# EasyEDA schematic SCH_New-Device-Whole-Board_2024-05-06.json

## Sheets
1 LED_Driver copy copy: TITLE: LED_Driver; REV: 1.0; Date: 2024-02-21; Sheet: 1/1; Company: Your Company
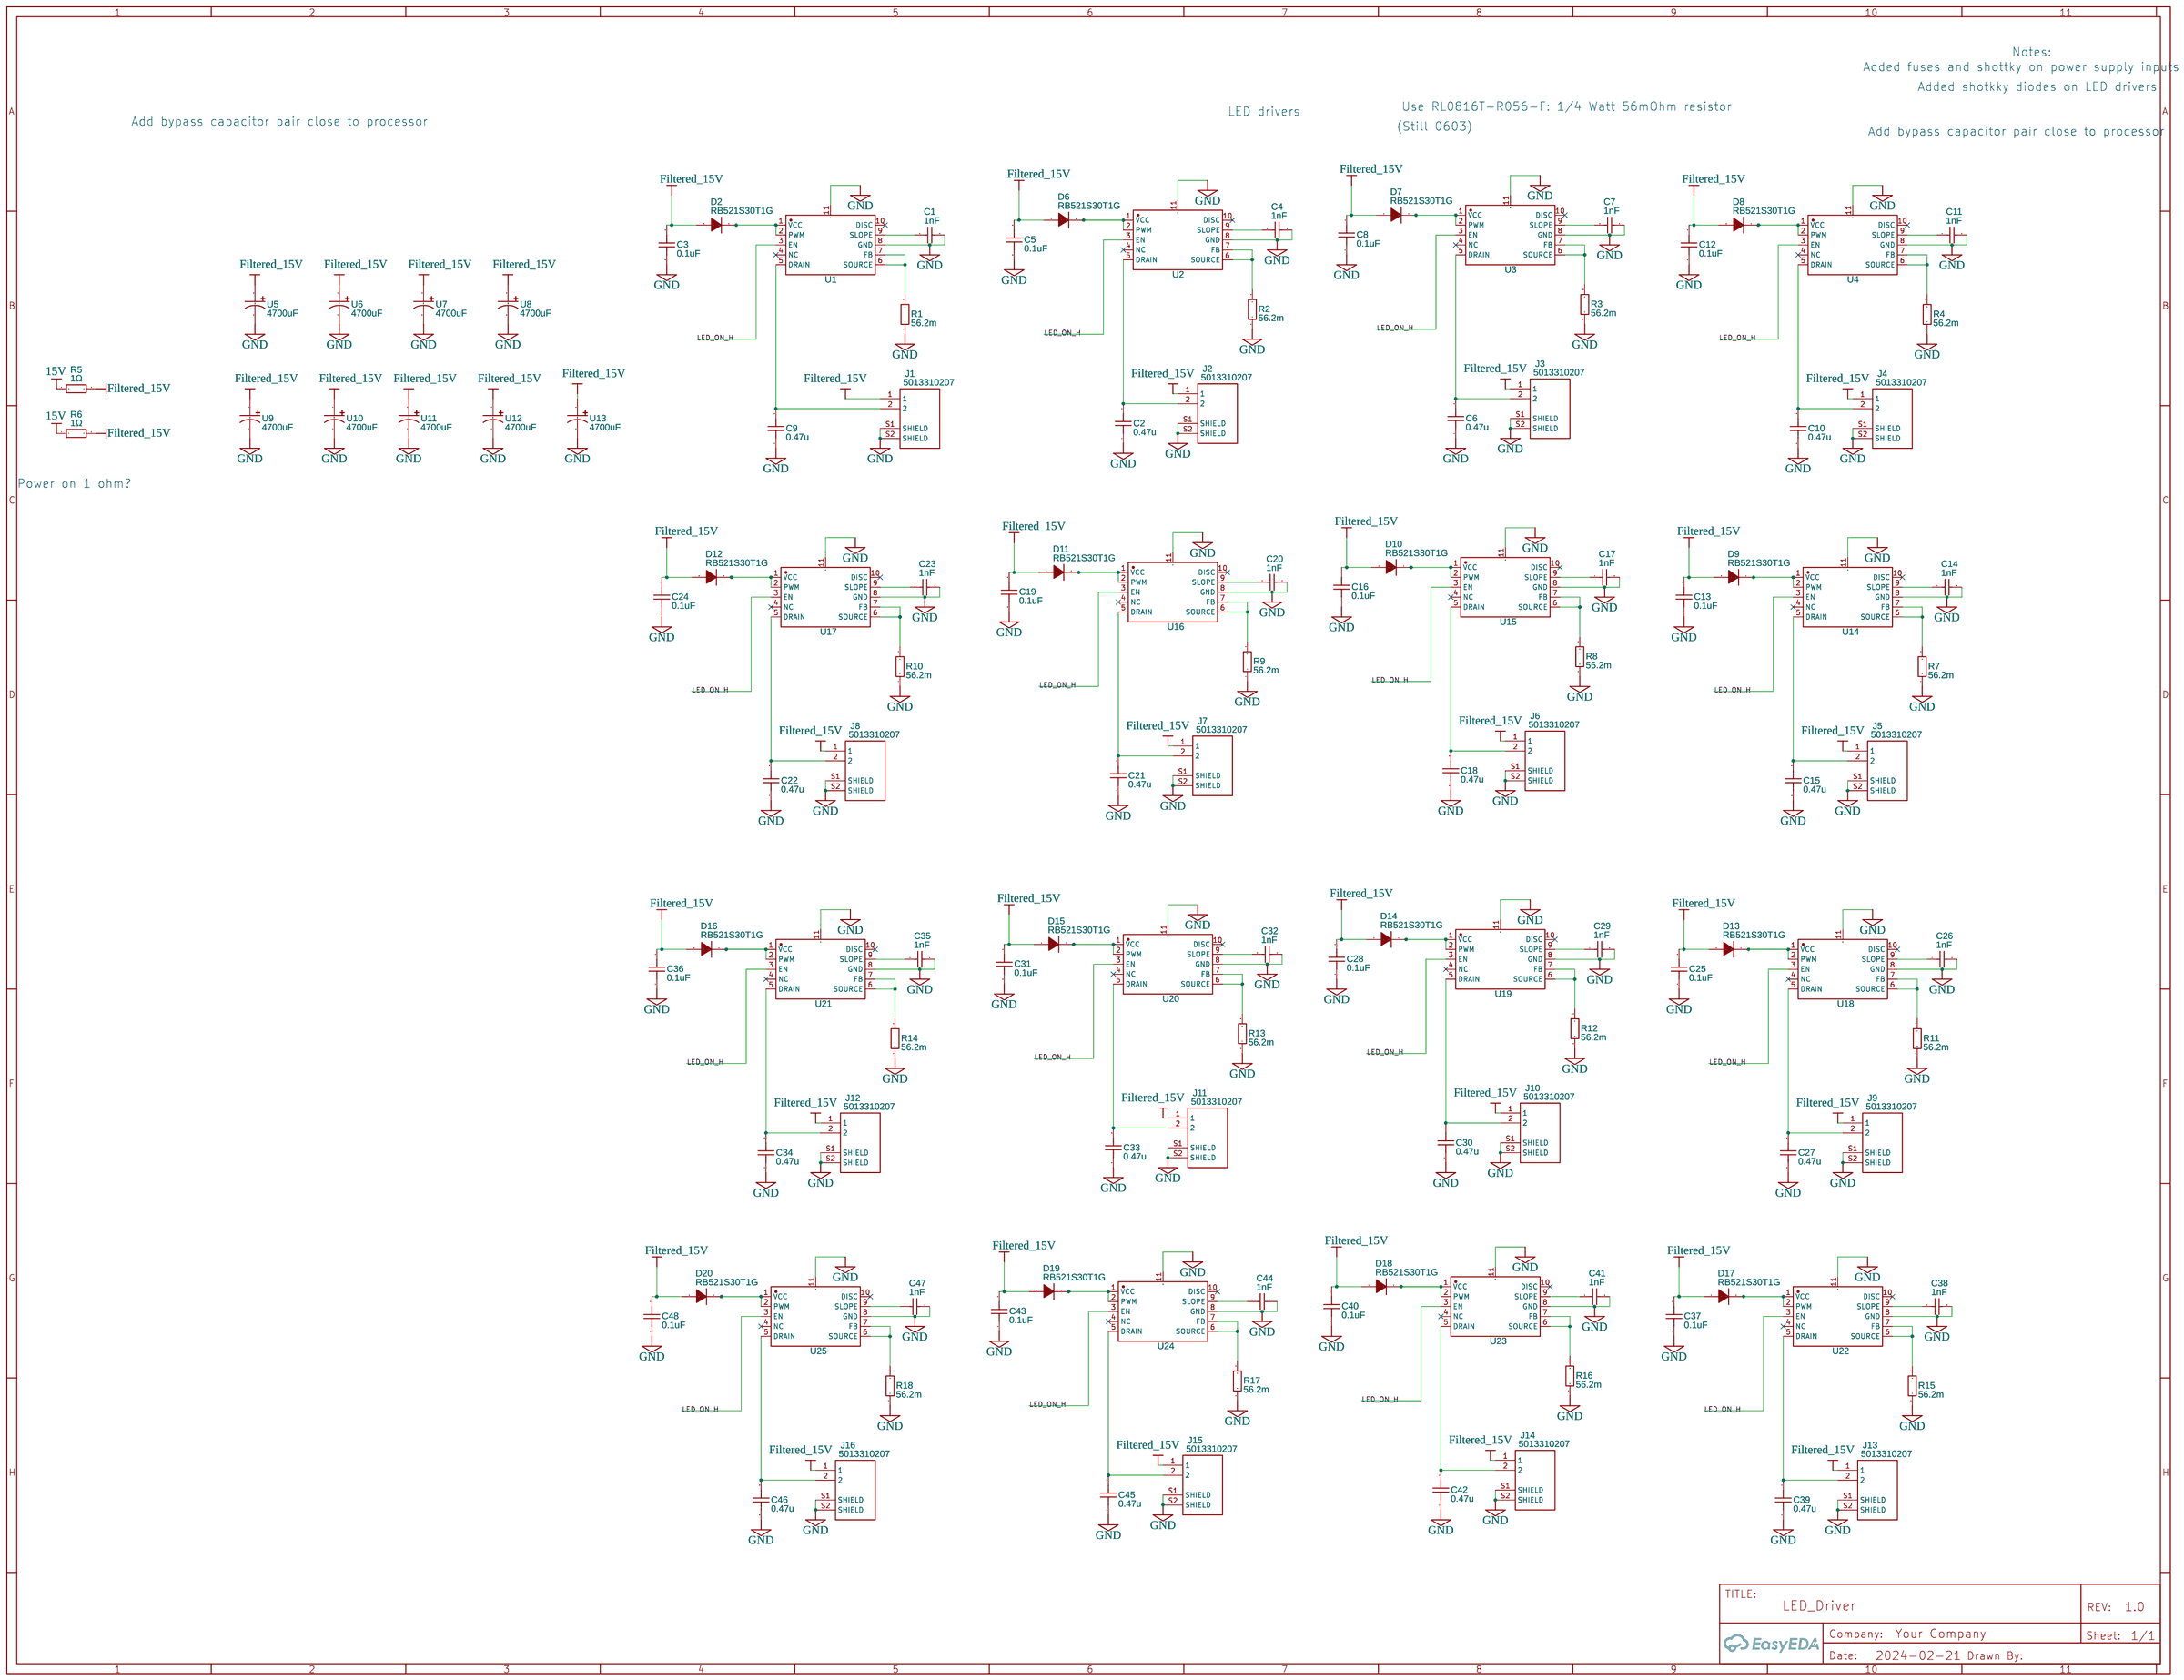
[diagram p0: LED_Driver copy copy]
2 Power_ORing copy copy: TITLE: Power_ORing
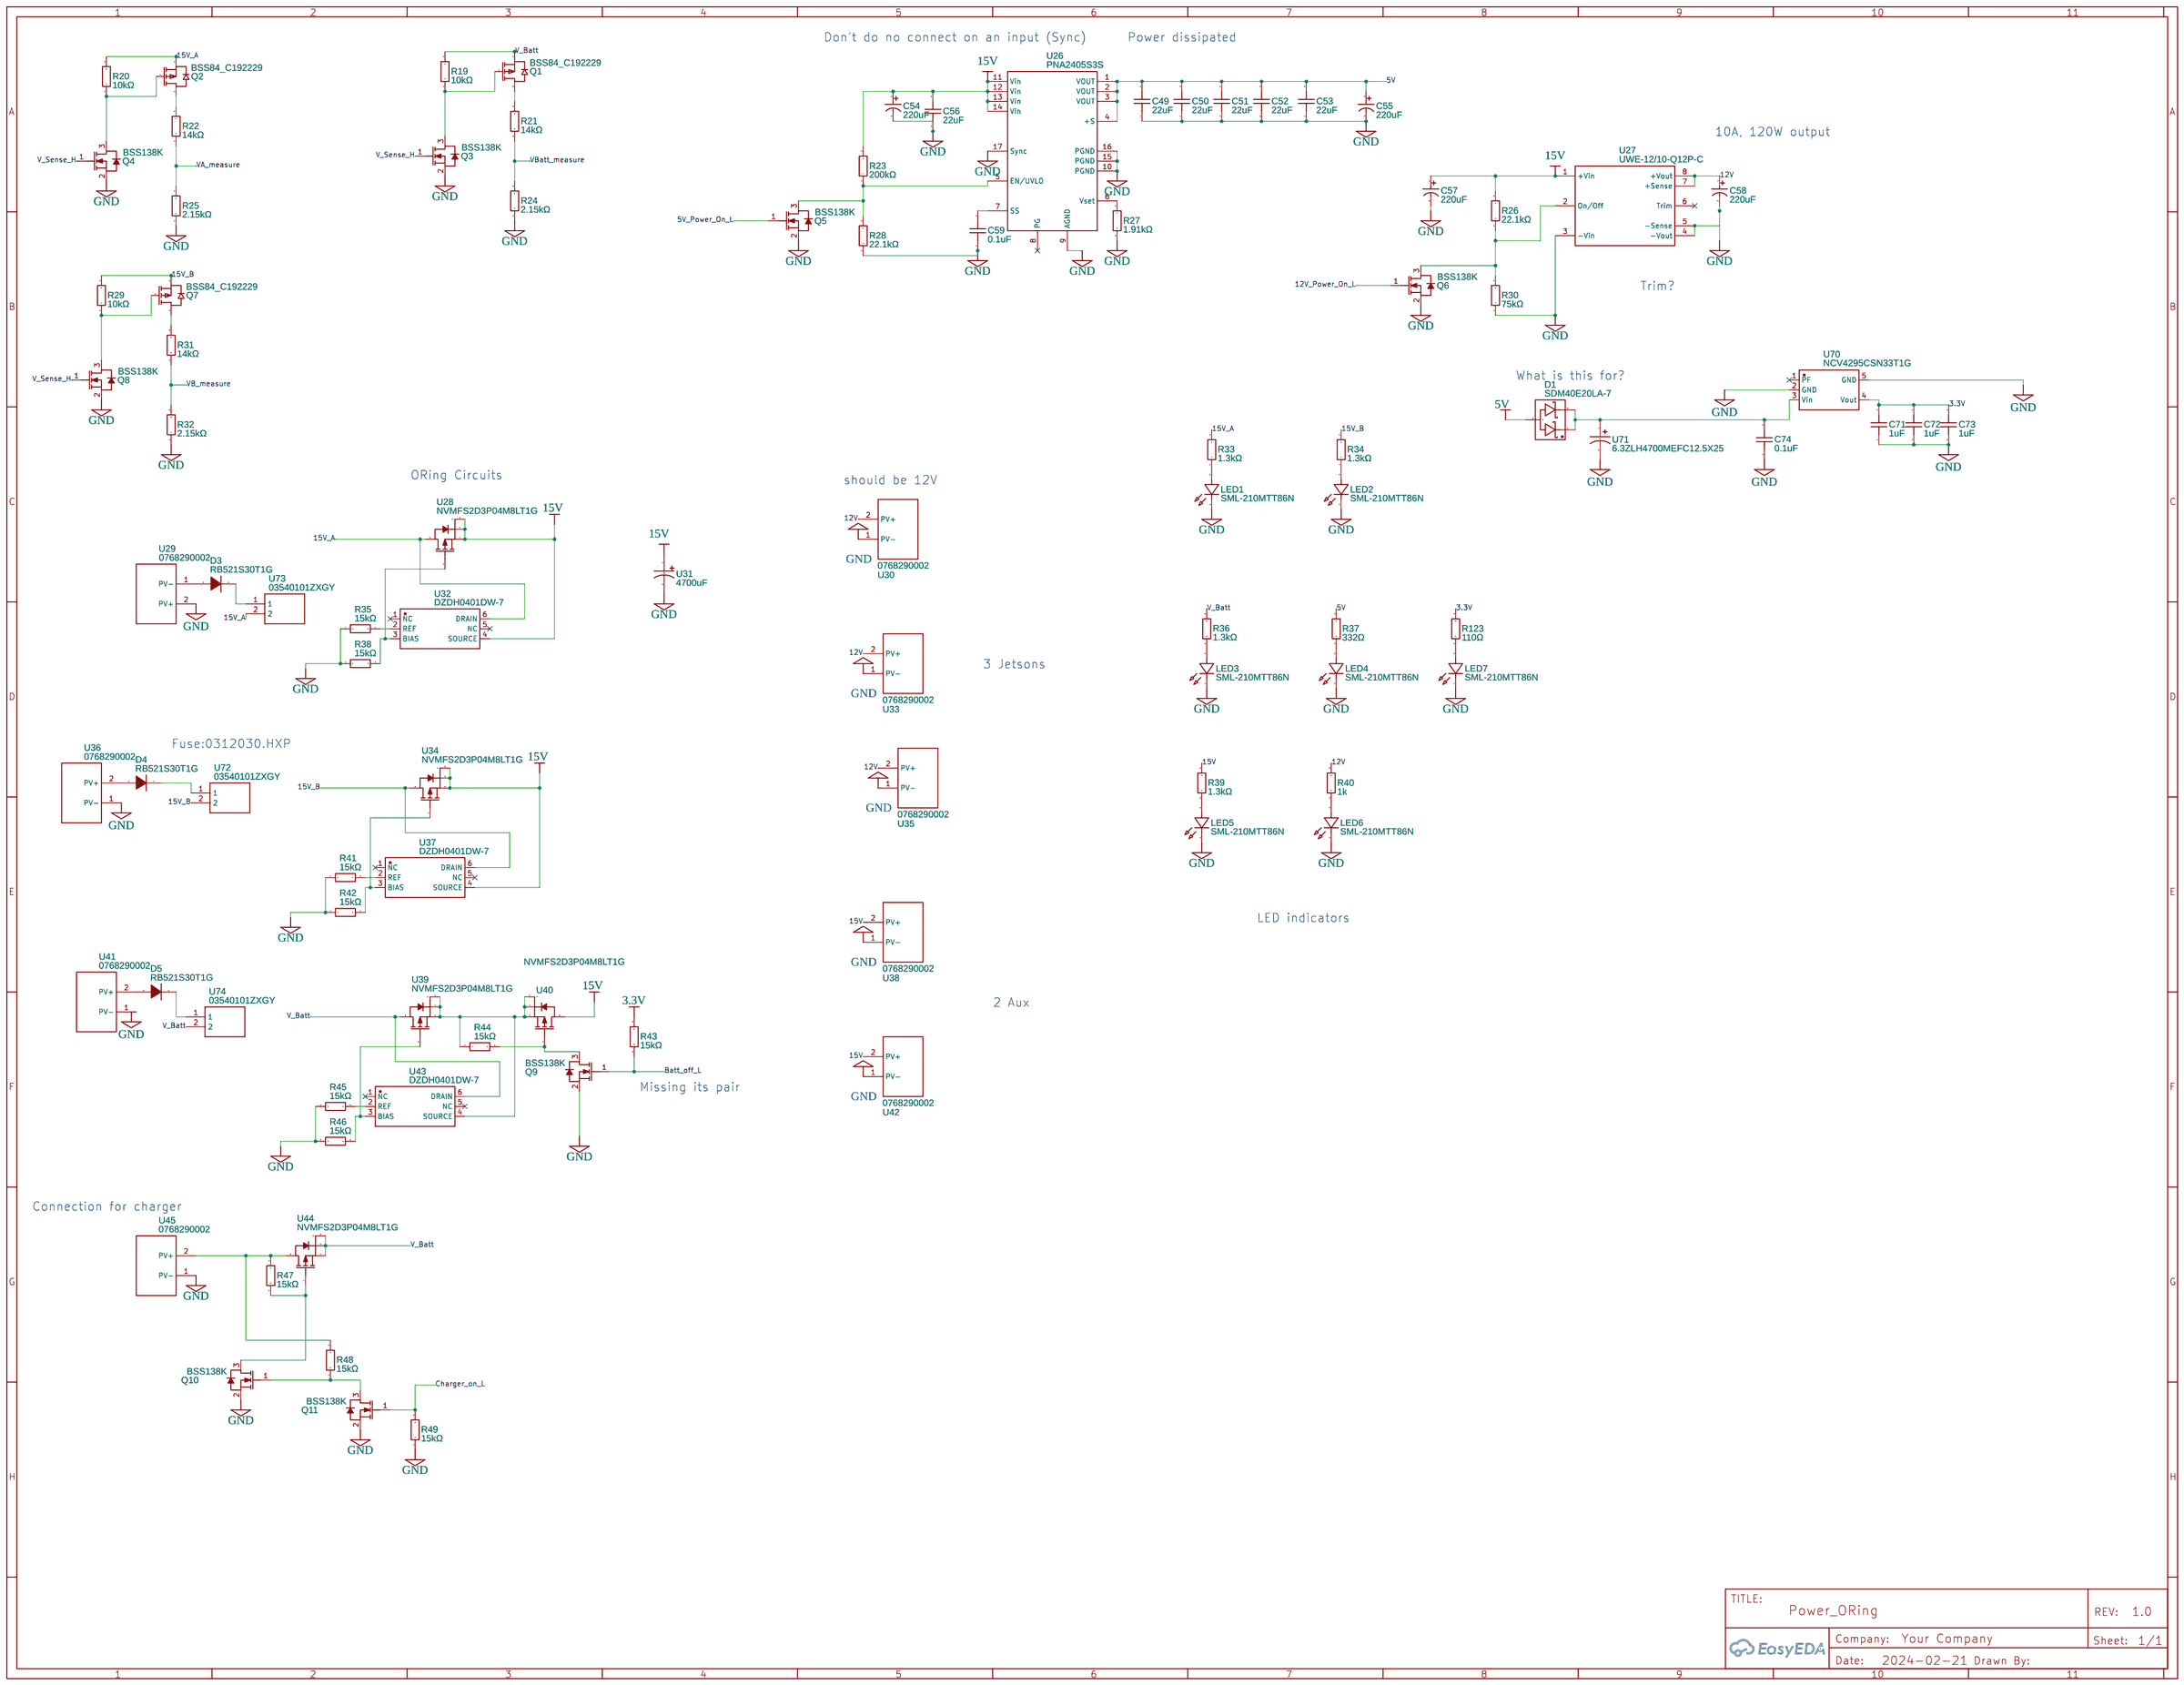
[diagram p1: Power_ORing copy copy]
3 Control copy copy
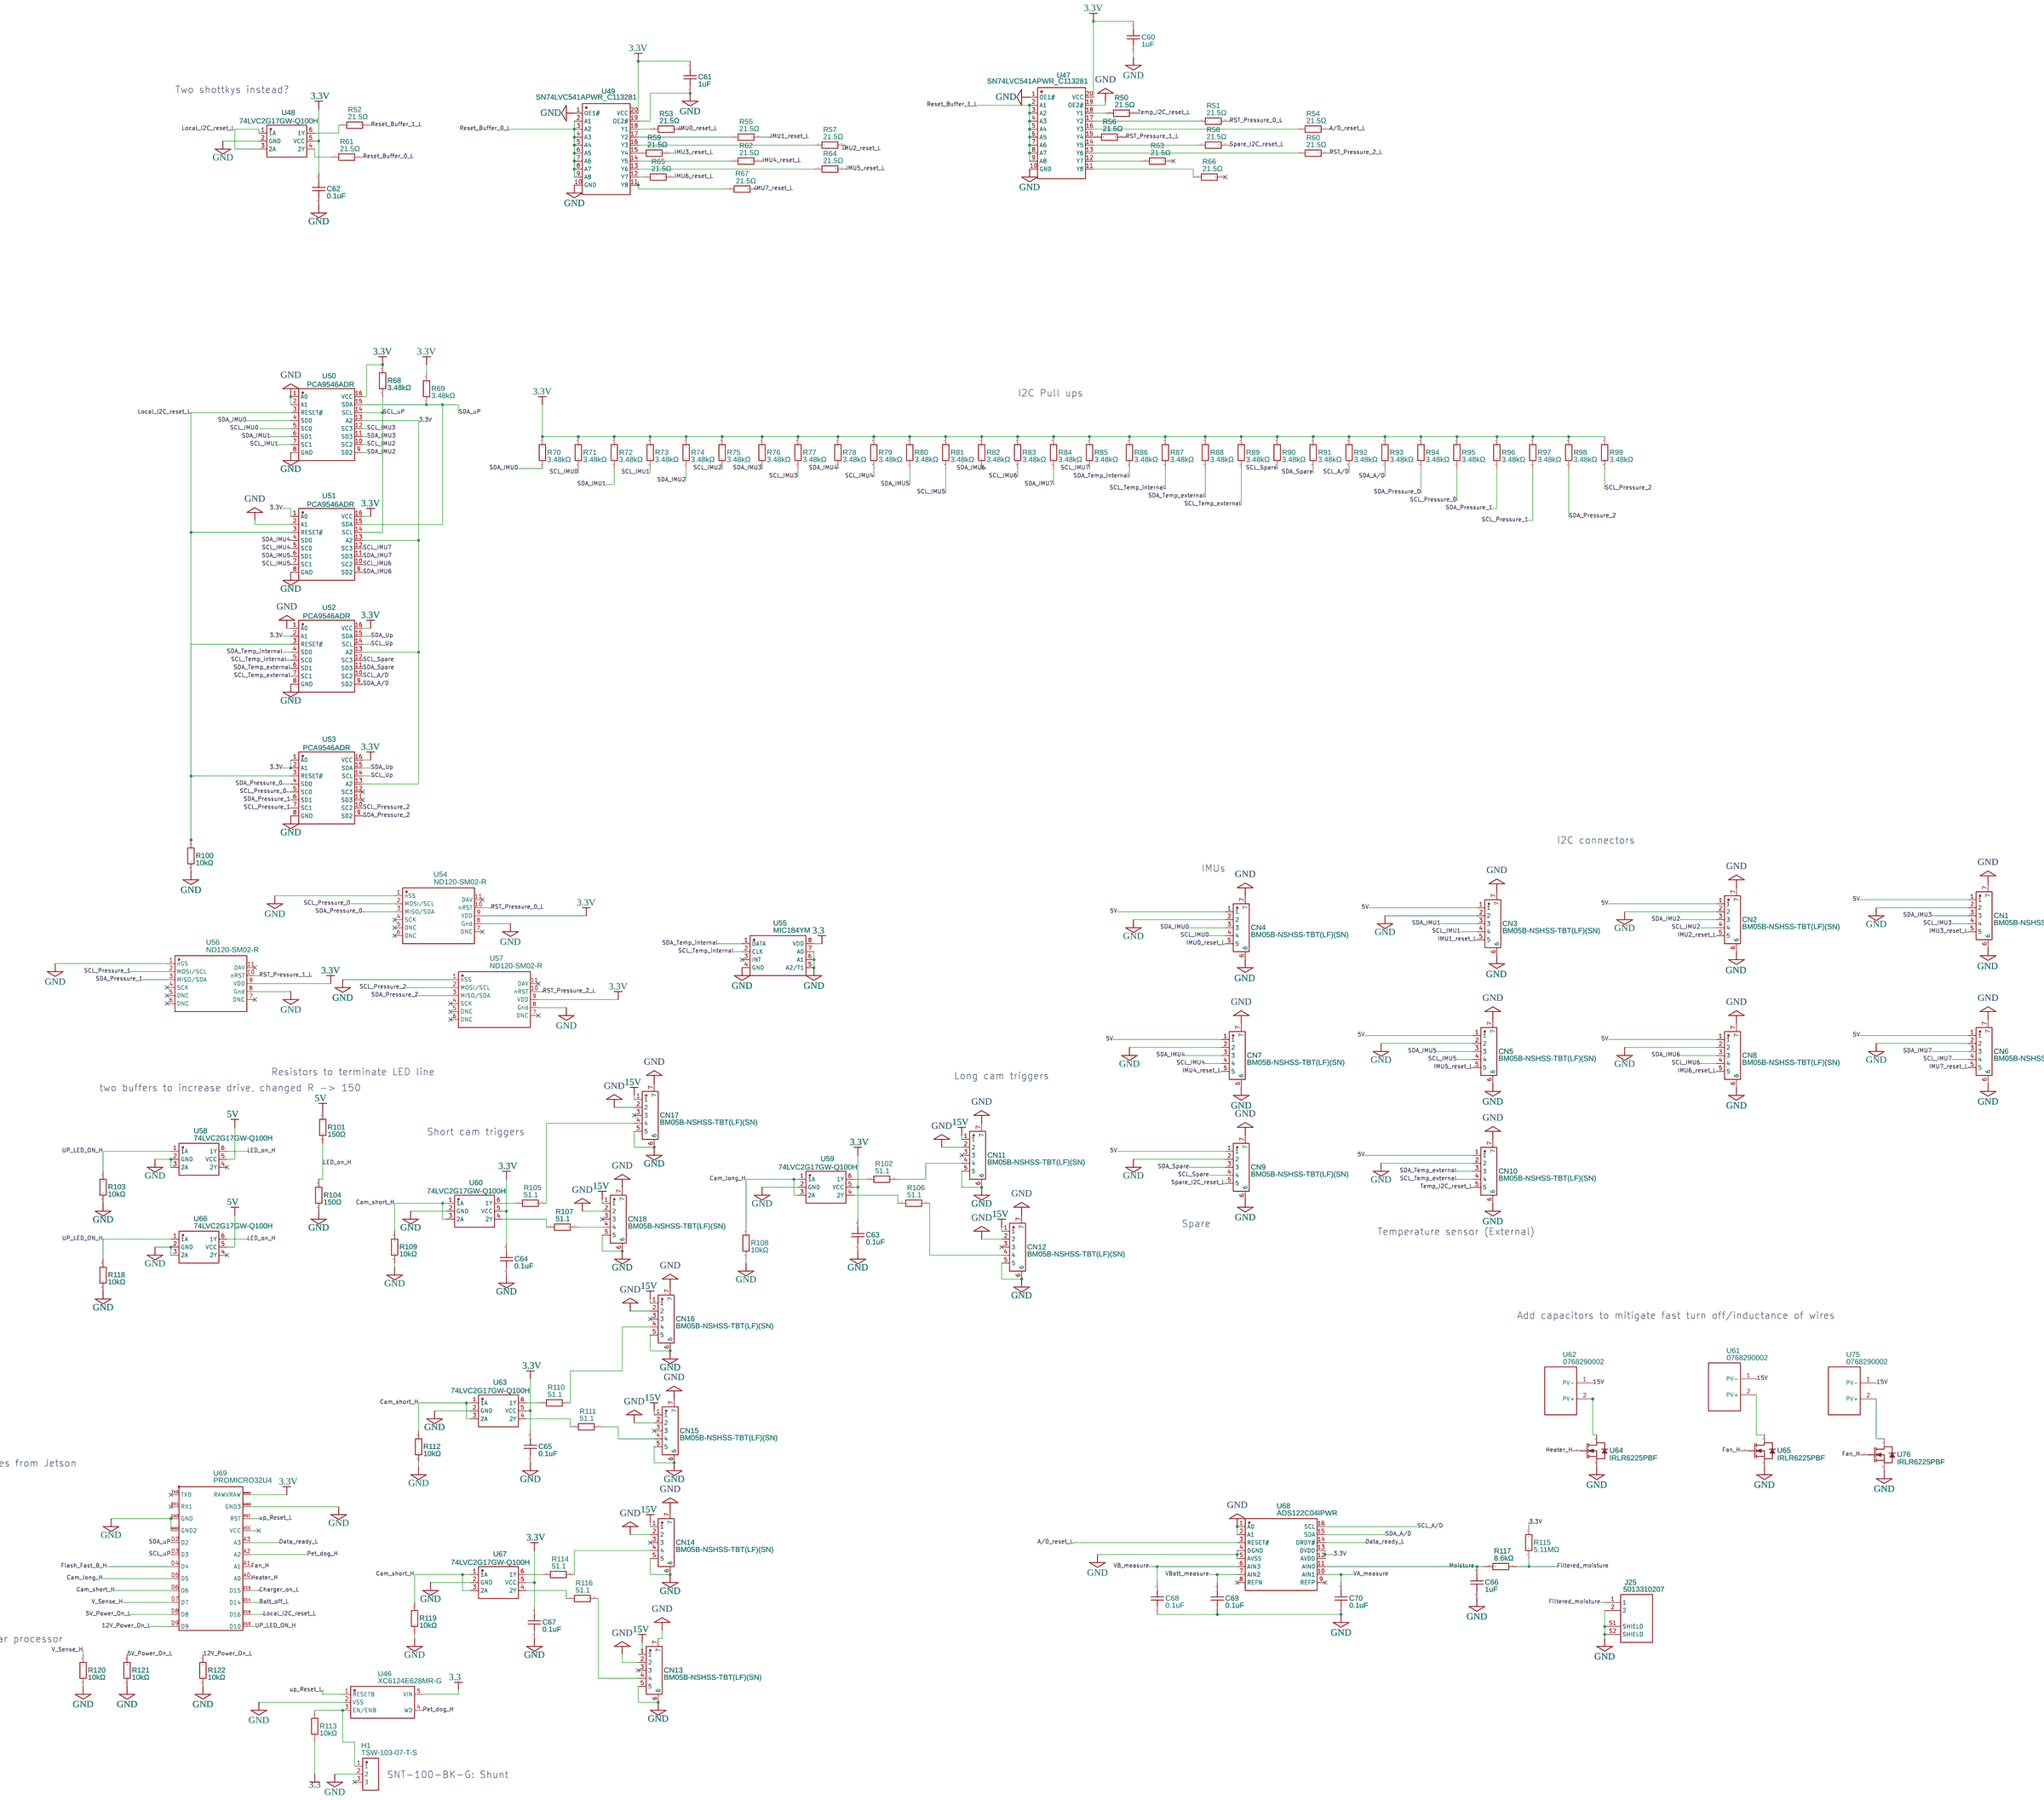
[diagram p2: Control copy copy]

## Parts
sheet Control copy copy
C60  1uF  [C0603]
C61  1uF  [C0603]
C62  0.1uF  [C0603]
C63  0.1uF  [C0603]
C64  0.1uF  [C0603]
C65  0.1uF  [C0603]
C66  1uF  [C0603]
C67  0.1uF  [C0603]
C68  0.1uF  [C0603]
C69  0.1uF  [C0603]
C70  0.1uF  [C0603]
CN1  BM05B-NSHSS-TBT(LF)(SN)  [CONN-SMD_BM05B-NSHSS-TBT]
CN2  BM05B-NSHSS-TBT(LF)(SN)  [CONN-SMD_BM05B-NSHSS-TBT]
CN3  BM05B-NSHSS-TBT(LF)(SN)  [CONN-SMD_BM05B-NSHSS-TBT]
CN4  BM05B-NSHSS-TBT(LF)(SN)  [CONN-SMD_BM05B-NSHSS-TBT]
CN5  BM05B-NSHSS-TBT(LF)(SN)  [CONN-SMD_BM05B-NSHSS-TBT]
CN6  BM05B-NSHSS-TBT(LF)(SN)  [CONN-SMD_BM05B-NSHSS-TBT]
CN7  BM05B-NSHSS-TBT(LF)(SN)  [CONN-SMD_BM05B-NSHSS-TBT]
CN8  BM05B-NSHSS-TBT(LF)(SN)  [CONN-SMD_BM05B-NSHSS-TBT]
CN9  BM05B-NSHSS-TBT(LF)(SN)  [CONN-SMD_BM05B-NSHSS-TBT]
CN10  BM05B-NSHSS-TBT(LF)(SN)  [CONN-SMD_BM05B-NSHSS-TBT]
CN11  BM05B-NSHSS-TBT(LF)(SN)  [CONN-SMD_BM05B-NSHSS-TBT]
CN12  BM05B-NSHSS-TBT(LF)(SN)  [CONN-SMD_BM05B-NSHSS-TBT]
CN13  BM05B-NSHSS-TBT(LF)(SN)  [CONN-SMD_BM05B-NSHSS-TBT]
CN14  BM05B-NSHSS-TBT(LF)(SN)  [CONN-SMD_BM05B-NSHSS-TBT]
CN15  BM05B-NSHSS-TBT(LF)(SN)  [CONN-SMD_BM05B-NSHSS-TBT]
CN16  BM05B-NSHSS-TBT(LF)(SN)  [CONN-SMD_BM05B-NSHSS-TBT]
CN17  BM05B-NSHSS-TBT(LF)(SN)  [CONN-SMD_BM05B-NSHSS-TBT]
CN18  BM05B-NSHSS-TBT(LF)(SN)  [CONN-SMD_BM05B-NSHSS-TBT]
H1  TSW-103-07-T-S  [HDR-TH_3P-P2.54-V-M-1]
J25  5013310207  [5013310207]
R50  21.5Ω  [R0603]
R51  21.5Ω  [R0603]
R52  21.5Ω  [R0603]
R53  21.5Ω  [R0603]
R54  21.5Ω  [R0603]
R55  21.5Ω  [R0603]
R56  21.5Ω  [R0603]
R57  21.5Ω  [R0603]
R58  21.5Ω  [R0603]
R59  21.5Ω  [R0603]
R60  21.5Ω  [R0603]
R61  21.5Ω  [R0603]
R62  21.5Ω  [R0603]
R63  21.5Ω  [R0603]
R64  21.5Ω  [R0603]
R65  21.5Ω  [R0603]
R66  21.5Ω  [R0603]
R67  21.5Ω  [R0603]
R68  3.48kΩ  [R0603]
R69  3.48kΩ  [R0603]
R70  3.48kΩ  [R0603]
R71  3.48kΩ  [R0603]
R72  3.48kΩ  [R0603]
R73  3.48kΩ  [R0603]
R74  3.48kΩ  [R0603]
R75  3.48kΩ  [R0603]
R76  3.48kΩ  [R0603]
R77  3.48kΩ  [R0603]
R78  3.48kΩ  [R0603]
R79  3.48kΩ  [R0603]
R80  3.48kΩ  [R0603]
R81  3.48kΩ  [R0603]
R82  3.48kΩ  [R0603]
R83  3.48kΩ  [R0603]
R84  3.48kΩ  [R0603]
R85  3.48kΩ  [R0603]
R86  3.48kΩ  [R0603]
R87  3.48kΩ  [R0603]
R88  3.48kΩ  [R0603]
R89  3.48kΩ  [R0603]
R90  3.48kΩ  [R0603]
R91  3.48kΩ  [R0603]
R92  3.48kΩ  [R0603]
R93  3.48kΩ  [R0603]
R94  3.48kΩ  [R0603]
R95  3.48kΩ  [R0603]
R96  3.48kΩ  [R0603]
R97  3.48kΩ  [R0603]
R98  3.48kΩ  [R0603]
R99  3.48kΩ  [R0603]
R100  10kΩ  [R0603]
R101  150Ω  [R0603]
R102  51.1  [R0603]
R103  10kΩ  [R0603]
R104  150Ω  [R0603]
R105  51.1  [R0603]
R106  51.1  [R0603]
R107  51.1  [R0603]
R108  10kΩ  [R0603]
R109  10kΩ  [R0603]
R110  51.1  [R0603]
R111  51.1  [R0603]
R112  10kΩ  [R0603]
R113  10kΩ  [R0402]
R114  51.1  [R0603]
R115  5.11MΩ  [R0603]
R116  51.1  [R0603]
R117  8.6kΩ  [R0603]
R118  10kΩ  [R0603]
R119  10kΩ  [R0603]
R120  10kΩ  [R0402]
R121  10kΩ  [R0402]
R122  10kΩ  [R0402]
U46  XC6124E628MR-G  [SOT-25-5_L2.9-W1.6-P0.95-LS2.8-BR]
U47  SN74LVC541APWR_C113281  [TSSOP-20_L6.5-W4.4-P0.65-LS6.4-BL]
U48  74LVC2G17GW-Q100H  [SC-88-6_L2.0-W1.3-P0.65-LS2.1-BL]
U49  SN74LVC541APWR_C113281  [TSSOP-20_L6.5-W4.4-P0.65-LS6.4-BL]
U50  PCA9546ADR  [SOIC-16_L9.9-W3.9-P1.27-LS6.0-BL]
U51  PCA9546ADR  [SOIC-16_L9.9-W3.9-P1.27-LS6.0-BL]
U52  PCA9546ADR  [SOIC-16_L9.9-W3.9-P1.27-LS6.0-BL]
U53  PCA9546ADR  [SOIC-16_L9.9-W3.9-P1.27-LS6.0-BL]
U54  ND120-SM02-R  [SENSOR-SMD_ND120-SM02-R]
U55  MIC184YM  [SOIC-8_L5.0-W4.0-P1.27-LS6.1-BL]
U56  ND120-SM02-R  [SENSOR-SMD_ND120-SM02-R]
U57  ND120-SM02-R  [SENSOR-SMD_ND120-SM02-R]
U58  74LVC2G17GW-Q100H  [SC-88-6_L2.0-W1.3-P0.65-LS2.1-BL]
U59  74LVC2G17GW-Q100H  [SC-88-6_L2.0-W1.3-P0.65-LS2.1-BL]
U60  74LVC2G17GW-Q100H  [SC-88-6_L2.0-W1.3-P0.65-LS2.1-BL]
U61  0768290002  [0768290002]
U62  0768290002  [0768290002]
U63  74LVC2G17GW-Q100H  [SC-88-6_L2.0-W1.3-P0.65-LS2.1-BL]
U64  IRLR6225PBF  [TO-252-2_L6.6-W6.1-P4.57-LS9.9-BR-CW]
U65  IRLR6225PBF  [TO-252-2_L6.6-W6.1-P4.57-LS9.9-BR-CW]
U66  74LVC2G17GW-Q100H  [SC-88-6_L2.0-W1.3-P0.65-LS2.1-BL]
U67  74LVC2G17GW-Q100H  [SC-88-6_L2.0-W1.3-P0.65-LS2.1-BL]
U68  ADS122C04IPWR  [TSSOP-16_L5.0-W4.4-P0.65-LS6.4-BL]
U69  PROMICRO32U4  [PROMICRO32U4]
U75  0768290002  [0768290002]
U76  IRLR6225PBF  [TO-252-2_L6.6-W6.1-P4.57-LS9.9-BR-CW]
sheet LED_Driver copy copy
C1  1nF  [C0603]
C2  0.47u  [C0603]
C3  0.1uF  [C0603]
C4  1nF  [C0603]
C5  0.1uF  [C0603]
C6  0.47u  [C0603]
C7  1nF  [C0603]
C8  0.1uF  [C0603]
C9  0.47u  [C0603]
C10  0.47u  [C0603]
C11  1nF  [C0603]
C12  0.1uF  [C0603]
C13  0.1uF  [C0603]
C14  1nF  [C0603]
C15  0.47u  [C0603]
C16  0.1uF  [C0603]
C17  1nF  [C0603]
C18  0.47u  [C0603]
C19  0.1uF  [C0603]
C20  1nF  [C0603]
C21  0.47u  [C0603]
C22  0.47u  [C0603]
C23  1nF  [C0603]
C24  0.1uF  [C0603]
C25  0.1uF  [C0603]
C26  1nF  [C0603]
C27  0.47u  [C0603]
C28  0.1uF  [C0603]
C29  1nF  [C0603]
C30  0.47u  [C0603]
C31  0.1uF  [C0603]
C32  1nF  [C0603]
C33  0.47u  [C0603]
C34  0.47u  [C0603]
C35  1nF  [C0603]
C36  0.1uF  [C0603]
C37  0.1uF  [C0603]
C38  1nF  [C0603]
C39  0.47u  [C0603]
C40  0.1uF  [C0603]
C41  1nF  [C0603]
C42  0.47u  [C0603]
C43  0.1uF  [C0603]
C44  1nF  [C0603]
C45  0.47u  [C0603]
C46  0.47u  [C0603]
C47  1nF  [C0603]
C48  0.1uF  [C0603]
D2  RB521S30T1G  [SOD-523_L1.2-W0.8-LS1.6-RD]
D6  RB521S30T1G  [SOD-523_L1.2-W0.8-LS1.6-RD]
D7  RB521S30T1G  [SOD-523_L1.2-W0.8-LS1.6-RD]
D8  RB521S30T1G  [SOD-523_L1.2-W0.8-LS1.6-RD]
D9  RB521S30T1G  [SOD-523_L1.2-W0.8-LS1.6-RD]
D10  RB521S30T1G  [SOD-523_L1.2-W0.8-LS1.6-RD]
D11  RB521S30T1G  [SOD-523_L1.2-W0.8-LS1.6-RD]
D12  RB521S30T1G  [SOD-523_L1.2-W0.8-LS1.6-RD]
D13  RB521S30T1G  [SOD-523_L1.2-W0.8-LS1.6-RD]
D14  RB521S30T1G  [SOD-523_L1.2-W0.8-LS1.6-RD]
D15  RB521S30T1G  [SOD-523_L1.2-W0.8-LS1.6-RD]
D16  RB521S30T1G  [SOD-523_L1.2-W0.8-LS1.6-RD]
D17  RB521S30T1G  [SOD-523_L1.2-W0.8-LS1.6-RD]
D18  RB521S30T1G  [SOD-523_L1.2-W0.8-LS1.6-RD]
D19  RB521S30T1G  [SOD-523_L1.2-W0.8-LS1.6-RD]
D20  RB521S30T1G  [SOD-523_L1.2-W0.8-LS1.6-RD]
J1  5013310207  [5013310207]
J2  5013310207  [5013310207]
J3  5013310207  [5013310207]
J4  5013310207  [5013310207]
J5  5013310207  [5013310207]
J6  5013310207  [5013310207]
J7  5013310207  [5013310207]
J8  5013310207  [5013310207]
J9  5013310207  [5013310207]
J10  5013310207  [5013310207]
J11  5013310207  [5013310207]
J12  5013310207  [5013310207]
J13  5013310207  [5013310207]
J14  5013310207  [5013310207]
J15  5013310207  [5013310207]
J16  5013310207  [5013310207]
R1  56.2m  [R0603]
R2  56.2m  [R0603]
R3  56.2m  [R0603]
R4  56.2m  [R0603]
R5  1Ω  [R2512]
R6  1Ω  [R2512]
R7  56.2m  [R0603]
R8  56.2m  [R0603]
R9  56.2m  [R0603]
R10  56.2m  [R0603]
R11  56.2m  [R0603]
R12  56.2m  [R0603]
R13  56.2m  [R0603]
R14  56.2m  [R0603]
R15  56.2m  [R0603]
R16  56.2m  [R0603]
R17  56.2m  [R0603]
R18  56.2m  [R0603]
U1  -  [POWERSO-10_L9.4-W7.5-P1.27-LS14.1-BL-EP]
U2  -  [POWERSO-10_L9.4-W7.5-P1.27-LS14.1-BL-EP]
U3  -  [POWERSO-10_L9.4-W7.5-P1.27-LS14.1-BL-EP]
U4  -  [POWERSO-10_L9.4-W7.5-P1.27-LS14.1-BL-EP]
U5  4700uF  [CAP-TH_BD18.0-P7.50-D0.8-FD]
U6  4700uF  [CAP-TH_BD18.0-P7.50-D0.8-FD]
U7  4700uF  [CAP-TH_BD18.0-P7.50-D0.8-FD]
U8  4700uF  [CAP-TH_BD18.0-P7.50-D0.8-FD]
U9  4700uF  [CAP-TH_BD18.0-P7.50-D0.8-FD]
U10  4700uF  [CAP-TH_BD18.0-P7.50-D0.8-FD]
U11  4700uF  [CAP-TH_BD18.0-P7.50-D0.8-FD]
U12  4700uF  [CAP-TH_BD18.0-P7.50-D0.8-FD]
U13  4700uF  [CAP-TH_BD18.0-P7.50-D0.8-FD]
U14  -  [POWERSO-10_L9.4-W7.5-P1.27-LS14.1-BL-EP]
U15  -  [POWERSO-10_L9.4-W7.5-P1.27-LS14.1-BL-EP]
U16  -  [POWERSO-10_L9.4-W7.5-P1.27-LS14.1-BL-EP]
U17  -  [POWERSO-10_L9.4-W7.5-P1.27-LS14.1-BL-EP]
U18  -  [POWERSO-10_L9.4-W7.5-P1.27-LS14.1-BL-EP]
U19  -  [POWERSO-10_L9.4-W7.5-P1.27-LS14.1-BL-EP]
U20  -  [POWERSO-10_L9.4-W7.5-P1.27-LS14.1-BL-EP]
U21  -  [POWERSO-10_L9.4-W7.5-P1.27-LS14.1-BL-EP]
U22  -  [POWERSO-10_L9.4-W7.5-P1.27-LS14.1-BL-EP]
U23  -  [POWERSO-10_L9.4-W7.5-P1.27-LS14.1-BL-EP]
U24  -  [POWERSO-10_L9.4-W7.5-P1.27-LS14.1-BL-EP]
U25  -  [POWERSO-10_L9.4-W7.5-P1.27-LS14.1-BL-EP]
sheet Power_ORing copy copy
C49  22uF  [C1210]
C50  22uF  [C1210]
C51  22uF  [C1210]
C52  22uF  [C1210]
C53  22uF  [C1210]
C54  220uF  [CAP-TH_BD6.3-P2.50-D1.0-FD]
C55  220uF  [CAP-TH_BD6.3-P2.50-D1.0-FD]
C56  22uF  [C1210]
C57  220uF  [CAP-TH_BD6.3-P2.50-D1.0-FD]
C58  220uF  [CAP-TH_BD6.3-P2.50-D1.0-FD]
C59  0.1uF  [C0603]
C71  1uF  [C0603]
C72  1uF  [C0603]
C73  1uF  [C0603]
C74  0.1uF  [C0603]
D1  SDM40E20LA-7  [SOT-23-3_L2.9-W1.3-P1.90-LS2.4-BR]
D3  RB521S30T1G  [SOD-523_L1.2-W0.8-LS1.6-RD]
D4  RB521S30T1G  [SOD-523_L1.2-W0.8-LS1.6-RD]
D5  RB521S30T1G  [SOD-523_L1.2-W0.8-LS1.6-RD]
LED1  SML-210MTT86N  [LED-SMD_L2.0-W1.3-RD]
LED2  SML-210MTT86N  [LED-SMD_L2.0-W1.3-RD]
LED3  SML-210MTT86N  [LED-SMD_L2.0-W1.3-RD]
LED4  SML-210MTT86N  [LED-SMD_L2.0-W1.3-RD]
LED5  SML-210MTT86N  [LED-SMD_L2.0-W1.3-RD]
LED6  SML-210MTT86N  [LED-SMD_L2.0-W1.3-RD]
LED7  SML-210MTT86N  [LED-SMD_L2.0-W1.3-RD]
Q1  BSS84_C192229  [SOT-23-3_L2.9-W1.3-P1.90-LS2.4-BR]
Q2  BSS84_C192229  [SOT-23-3_L2.9-W1.3-P1.90-LS2.4-BR]
Q3  BSS138K  [SOT-23-3_L3.0-W1.7-P0.95-LS2.9-BR]
Q4  BSS138K  [SOT-23-3_L3.0-W1.7-P0.95-LS2.9-BR]
Q5  BSS138K  [SOT-23-3_L3.0-W1.7-P0.95-LS2.9-BR]
Q6  BSS138K  [SOT-23-3_L3.0-W1.7-P0.95-LS2.9-BR]
Q7  BSS84_C192229  [SOT-23-3_L2.9-W1.3-P1.90-LS2.4-BR]
Q8  BSS138K  [SOT-23-3_L3.0-W1.7-P0.95-LS2.9-BR]
Q9  BSS138K  [SOT-23-3_L3.0-W1.7-P0.95-LS2.9-BR]
Q10  BSS138K  [SOT-23-3_L3.0-W1.7-P0.95-LS2.9-BR]
Q11  BSS138K  [SOT-23-3_L3.0-W1.7-P0.95-LS2.9-BR]
R19  10kΩ  [R0402]
R20  10kΩ  [R0402]
R21  14kΩ  [R0402]
R22  14kΩ  [R0402]
R23  200kΩ  [R0402]
R24  2.15kΩ  [R0402]
R25  2.15kΩ  [R0402]
R26  22.1kΩ  [R0402]
R27  1.91kΩ  [R0402]
R28  22.1kΩ  [R0402]
R29  10kΩ  [R0402]
R30  75kΩ  [R0402]
R31  14kΩ  [R0402]
R32  2.15kΩ  [R0402]
R33  1.3kΩ  [R0805]
R34  1.3kΩ  [R0805]
R35  15kΩ  [R0603]
R36  1.3kΩ  [R0805]
R37  332Ω  [R0603]
R38  15kΩ  [R0603]
R39  1.3kΩ  [R0805]
R40  1k  [R0603]
R41  15kΩ  [R0603]
R42  15kΩ  [R0603]
R43  15kΩ  [R0603]
R44  15kΩ  [R0603]
R45  15kΩ  [R0603]
R46  15kΩ  [R0603]
R47  15kΩ  [R0603]
R48  15kΩ  [R0603]
R49  15kΩ  [R0603]
R123  110Ω  [R0603]
U26  PNA2405S3S  [PNA2405S3S_UVMEDICO]
U27  UWE-12/10-Q12P-C  [UWE-100-120W]
U28  NVMFS2D3P04M8LT1G  [DFN-5_L4.9-W5.9-P1.27-LS6.2-BL]
U29  0768290002  [0768290002]
U30  0768290002  [0768290002]
U31  4700uF  [CAP-TH_BD18.0-P7.50-D0.8-FD]
U32  DZDH0401DW-7  [SOT-363_L2.0-W1.3-P0.65-LS2.1-BR]
U33  0768290002  [0768290002]
U34  NVMFS2D3P04M8LT1G  [DFN-5_L4.9-W5.9-P1.27-LS6.2-BL]
U35  0768290002  [0768290002]
U36  0768290002  [0768290002]
U37  DZDH0401DW-7  [SOT-363_L2.0-W1.3-P0.65-LS2.1-BR]
U38  0768290002  [0768290002]
U39  NVMFS2D3P04M8LT1G  [DFN-5_L4.9-W5.9-P1.27-LS6.2-BL]
U40  NVMFS2D3P04M8LT1G  [DFN-5_L4.9-W5.9-P1.27-LS6.2-BL]
U41  0768290002  [0768290002]
U42  0768290002  [0768290002]
U43  DZDH0401DW-7  [SOT-363_L2.0-W1.3-P0.65-LS2.1-BR]
U44  NVMFS2D3P04M8LT1G  [DFN-5_L4.9-W5.9-P1.27-LS6.2-BL]
U45  0768290002  [0768290002]
U70  NCV4295CSN33T1G  [TSOP-5_L3.0-W1.5-P0.95-LS2.8-BR]
U71  6.3ZLH4700MEFC12.5X25  [CAP-TH_BD12.5-P5.00-D0.6-FD]
U72  03540101ZXGY  [03540101ZXGY]
U73  03540101ZXGY  [03540101ZXGY]
U74  03540101ZXGY  [03540101ZXGY]

## Library data of the parts
C3 C5 C8 C12 C13 C16 C19 C24 C25 C28 C31 C36 C37 C40 C43 C48 C59-C74 = 0603CG0R1C500NT: Contributor: LCSC; Supplier: LCSC; Supplier Part: C1322361; Manufacturer: FH(风华); JLCPCB Part Class: Extended Part; link: https://lcsc.com/eda_search?q=C1322361&%26type=1&ref=editor
CN1-CN18 = BM05B-NSHSS-TBT(LF)(SN): Contributor: lcsc; Supplier: LCSC; Supplier Part: C5305466; Manufacturer: JST; JLCPCB Part Class: Extended Part
H1 = TSW-103-07-T-S: Supplier: LCSC; Supplier Part: C6292175; Manufacturer: SAMTEC; Contributor: lcsc
J1-J16 J25 = 5013310207: Connector Header Surface Mount 2 position 0.039" (1.00mm); Manufacturer: Molex; Supplier: Digi-Key; Supplier Part: WM7879CT-ND; Contributor: Martin Laflamme
R50-R67 R102 R103 R105-R112 R114 R116 R118 R119 = 0603WAF1002T5E: Supplier: LCSC; Manufacturer: UNI-ROYAL(厚声); Supplier Part: C25804; JLCPCB Part Class: Basic Part
R68-R101 R104 R115 R117 = 0603WAF1500T5E: Supplier: LCSC; Manufacturer: UNI-ROYAL(厚声); Supplier Part: C22808; JLCPCB Part Class: Basic Part
R19-R32 R113 R120-R122 = RC0402JR-070RL: Supplier: LCSC; Manufacturer: YAGEO(国巨); Supplier Part: C60485; JLCPCB Part Class: Extended Part
U46 = XC6124E628MR-G: Contributor: lcsc; Supplier: LCSC; Supplier Part: C3688049; Manufacturer: TOREX(特瑞仕)
U47 U49 = SN74LVC541APWR_C113281: Supplier: LCSC; Manufacturer: TI(德州仪器); Manufacturer Part: SN74LVC541APWR; Supplier Part: C113281; JLCPCB Part Class: Extended Part
U48 U58-U60 U63 U66 U67 = 74LVC2G17GW-Q100H: Contributor: LCSC; Supplier: LCSC; Supplier Part: C548614; Manufacturer: Nexperia(安世); JLCPCB Part Class: Extended Part
U50-U53 = PCA9546ADR: Contributor: LCSC; Supplier: LCSC; Supplier Part: C2674051; Manufacturer: TI(德州仪器); JLCPCB Part Class: Extended Part
U54 U56 U57 = ND120-SM02-R: Contributor: lcsc; Supplier: LCSC; Supplier Part: C9900020487; Manufacturer: null; JLCPCB Part Class: Extended Part
U55 = MIC184YM: Contributor: lcsc; Supplier: LCSC; Supplier Part: C637433; Manufacturer: MICROCHIP(美国微芯); link: https://lcsc.com/eda_search?q=C637433&%26type=1&ref=editor
U29 U30 U33 U35 U36 U38 U41 U42 U45 U61 U62 U75 = 0768290002: Contributor: luisy
U64 U65 U76 = IRLR6225PBF: Contributor: lcsc; Supplier: LCSC; Supplier Part: C3277930; Manufacturer: Infineon(英飞凌); JLCPCB Part Class: Extended Part
U68 = ADS122C04IPWR: Contributor: LCSC; Supplier: LCSC; Supplier Part: C2872338; Manufacturer: TI(德州仪器); JLCPCB Part Class: Extended Part
U69 = PROMICRO32U4: Contributor: alejandro.hdz.eqz
C1 C4 C7 C11 C14 C17 C20 C23 C26 C29 C32 C35 C38 C41 C44 C47 = CC0603KRX7R9BB102: Supplier: LCSC; Manufacturer: YAGEO(国巨); Supplier Part: C100040; JLCPCB Part Class: Extended Part
C2 C6 C9 C10 C15 C18 C21 C22 C27 C30 C33 C34 C39 C42 C45 C46 = 0603CG0R1C500NT: Contributor: LCSC; Supplier: LCSC; Supplier Part: C1322361; Manufacturer: FH(风华); JLCPCB Part Class: Extended Part
D2-D20 = RB521S30T1G: Contributor: LCSC; Supplier: LCSC; Supplier Part: C145179; Manufacturer: onsemi(安森美); JLCPCB Part Class: Extended Part
R1-R4 R7-R18 = 0603WAJ0101T5E: Supplier: LCSC; Manufacturer: UNI-ROYAL(厚声); Supplier Part: C25201; JLCPCB Part Class: Extended Part
R5 R6 = 25121WF100KT4E: Supplier: LCSC; Manufacturer: UNI-ROYAL(厚声); Supplier Part: C11254; JLCPCB Part Class: Extended Part
U1-U4 U14-U25 = STCS2ASPR: Contributor: LCSC; Supplier: LCSC; Supplier Part: C2653383; Manufacturer: ST(意法半导体); JLCPCB Part Class: Extended Part
U5-U13 U31 = B41858C7478M000: Contributor: lcsc; Supplier: LCSC; Supplier Part: C1668895; Manufacturer: TDK
C49-C53 C56 = CL32B226KAJNNNE: Contributor: LCSC; Supplier: LCSC; Supplier Part: C309062; Manufacturer: SAMSUNG(三星); JLCPCB Part Class: Extended Part
C54 C55 C57 C58 = 25YXJ220M6.3X11: Supplier: LCSC; Manufacturer: rubycon(红宝石); Supplier Part: C88729; JLCPCB Part Class: Extended Part
D1 = SDM40E20LA-7: Contributor: LCSC; Supplier: LCSC; Supplier Part: C460109; Manufacturer: DIODES(美台); JLCPCB Part Class: Extended Part
LED1-LED7 = SML-210MTT86N: Contributor: LCSC; Supplier: LCSC; Supplier Part: C600868; Manufacturer: ROHM(罗姆); JLCPCB Part Class: Extended Part
Q1 Q2 Q7 = BSS84_C192229: Contributor: LCSC; Supplier: LCSC; Supplier Part: C192229; Manufacturer: FMS(美丽微); Manufacturer Part: BSS84; JLCPCB Part Class: Extended Part
Q3-Q6 Q8-Q11 = BSS138K: Contributor: LCSC; Supplier: LCSC; Supplier Part: C255592; Manufacturer: onsemi(安森美); JLCPCB Part Class: Extended Part
R33 R34 R36 R39 = RK73H2ATTD1301F: Contributor: LCSC; Supplier: LCSC; Supplier Part: C276218; Manufacturer: KOA; JLCPCB Part Class: Extended Part
R35 R38 R41-R49 = 0603WAF1502T5E: Supplier: LCSC; Manufacturer: UNI-ROYAL(厚声); Supplier Part: C22809; JLCPCB Part Class: Basic Part
R37 R123 = ARG03FTC3320: Contributor: LCSC; Supplier: LCSC; Supplier Part: C217970; Manufacturer: Viking(光颉); JLCPCB Part Class: Extended Part
R40 = ARG03FTC3320: Contributor: LCSC; Supplier: LCSC; Supplier Part: C217970; Manufacturer: Viking(光颉); JLCPCB Part Class: Extended Part; link: https://lcsc.com/eda_search?q=C217970&%26type=1&ref=editor
U26 = PNA2405S3S: Manufacturer: FLEX; link: https://flexpowermodules.com/resources/fpm-techspec-pna; Contributor: Ramlac
U27 = UWE-12/10-Q12P-C: Manufacturer: Murata Power Solutions; Manufacturer Part: UEI30-050-Q12P-C; Supplier: Element14; link: http://www.farnell.com/datasheets/2612110.pdf; Contributor: antoine510
U28 U34 U39 U40 U44 = NVMFS2D3P04M8LT1G: Contributor: lcsc; Supplier: LCSC; Supplier Part: C3277741; Manufacturer: onsemi(安森美)
U32 U37 U43 = DZDH0401DW-7: Contributor: lcsc; Supplier: LCSC; Supplier Part: C3235552; Manufacturer: DIODES(美台)
U70 = NCV4295CSN33T1G: Contributor: LCSC; Supplier: LCSC; Supplier Part: C603940; Manufacturer: onsemi(安森美)
U71 = 6.3ZLH4700MEFC12.5X25: Contributor: lcsc; Supplier: LCSC; Supplier Part: C1587424; Manufacturer: rubycon(红宝石)
U72-U74 = 03540101ZXGY: Contributor: Gowthamsai14

## Nets
3.3V: C60.1 C61.2 C62.2 C63.2 C64.2 C65.2 C67.2 C71.2 C72.2 C73.2 R43.2 R68.2 R69.2 R70.2 R71.2 R72.2 R73.2 R74.2 R75.2 R76.2 R77.2 R78.2 R79.2 R80.2 R81.2 R82.2 R83.2 R84.2 R85.2 R86.2 R87.2 R88.2 R89.2 R90.2 R91.2 R92.2 R93.2 R94.2 R95.2 R96.2 R97.2 R98.2 R99.2 R115.1 R123.2 U47.20(VCC) U48.5(VCC) U49.20(VCC) U50.13(A2) U50.16(VCC) U51.1(A0) U51.13(A2) U51.16(VCC) U52.2(A1) U52.13(A2) U52.16(VCC) U53.1(A0) U53.2(A1) U53.13(A2) U53.16(VCC) U54.9(VDD) U56.9(VDD) U57.9(VDD) U59.5(VCC) U60.5(VCC) U63.5(VCC) U67.5(VCC) U68.12(AVDD) U68.13(DVDD) U69.RAWVRAW U70.4(Vout)
5V: C49.2 C50.2 C51.2 C52.2 C53.2 C55.1 CN1.1 CN2.1 CN3.1 CN4.1 CN5.1 CN6.1 CN7.1 CN8.1 CN9.1 CN10.1 D1.3 R37.2 R101.2 U26.1(VOUT) U26.2(VOUT) U26.3(VOUT) U26.4(+S) U58.5(VCC) U66.5(VCC)
5V_Power_On_L: Q5.1(G) R121.2 U69.D8
12V: C58.1 R40.2 U27.7(+Sense) U27.8(+Vout) U30.2(PV+) U33.2(PV+) U35.2(PV+)
12V_Power_On_L: Q6.1(G) R122.2 U69.D9
15V: C54.1 C56.2 C57.1 CN11.1 CN12.1 CN13.1 CN14.1 CN15.1 CN16.1 CN17.1 CN18.1 R5.1 R6.1 R23.2 R26.2 R39.2 U26.11(Vin) U26.12(Vin) U26.13(Vin) U26.14(Vin) U27.1(+Vin) U28.1(S) U28.2(S) U28.3(S) U31.1 U32.4(SOURCE) U34.1(S) U34.2(S) U34.3(S) U37.4(SOURCE) U38.2(PV+) U40.5(D) U42.2(PV+) U61.1(PV-) U62.1(PV-) U75.1(PV-)
15V_A: Q2.2(S) R20.2 R33.2 U28.5(D) U32.6(DRAIN) U73.2
15V_B: Q7.2(S) R29.2 R34.2 U34.5(D) U37.6(DRAIN) U72.2
GND: C1.2 C2.1 C3.1 C4.2 C5.1 C6.1 C7.2 C8.1 C9.1 C10.1 C11.2 C12.1 C13.1 C14.2 C15.1 C16.1 C17.2 C18.1 C19.1 C20.2 C21.1 C22.1 C23.2 C24.1 C25.1 C26.2 C27.1 C28.1 C29.2 C30.1 C31.1 C32.2 C33.1 C34.1 C35.2 C36.1 C37.1 C38.2 C39.1 C40.1 C41.2 C42.1 C43.1 C44.2 C45.1 C46.1 C47.2 C48.1 C49.1 C50.1 C51.1 C52.1 C53.1 C54.2 C55.2 C56.1 C57.2 C58.2 C59.1 C60.2 C61.1 C62.1 C63.1 C64.1 C65.1 C66.1 C67.1 C68.1 C69.1 C70.1 C71.1 C72.1 C73.1 C74.1 CN1.2 CN1.6 CN1.7 CN2.2 CN2.6 CN2.7 CN3.2 CN3.6 CN3.7 CN4.2 CN4.6 CN4.7 CN5.2 CN5.6 CN5.7 CN6.2 CN6.6 CN6.7 CN7.2 CN7.6 CN7.7 CN8.2 CN8.6 CN8.7 CN9.2 CN9.6 CN9.7 CN10.2 CN10.6 CN10.7 CN11.2 CN11.5 CN11.6 CN11.7 CN12.2 CN12.5 CN12.6 CN12.7 CN13.2 CN13.5 CN13.6 CN13.7 CN14.2 CN14.5 CN14.6 CN14.7 CN15.2 CN15.5 CN15.6 CN15.7 CN16.2 CN16.5 CN16.6 CN16.7 CN17.2 CN17.5 CN17.6 CN17.7 CN18.2 CN18.5 CN18.6 CN18.7 H1.2 J1.S1(SHIELD) J1.S2(SHIELD) J2.S1(SHIELD) J2.S2(SHIELD) J3.S1(SHIELD) J3.S2(SHIELD) J4.S1(SHIELD) J4.S2(SHIELD) J5.S1(SHIELD) J5.S2(SHIELD) J6.S1(SHIELD) J6.S2(SHIELD) J7.S1(SHIELD) J7.S2(SHIELD) J8.S1(SHIELD) J8.S2(SHIELD) J9.S1(SHIELD) J9.S2(SHIELD) J10.S1(SHIELD) J10.S2(SHIELD) J11.S1(SHIELD) J11.S2(SHIELD) J12.S1(SHIELD) J12.S2(SHIELD) J13.S1(SHIELD) J13.S2(SHIELD) J14.S1(SHIELD) J14.S2(SHIELD) J15.S1(SHIELD) J15.S2(SHIELD) J16.S1(SHIELD) J16.S2(SHIELD) J25.2 J25.S1(SHIELD) J25.S2(SHIELD) LED1.1(K) LED2.1(K) LED3.1(K) LED4.1(K) LED5.1(K) LED6.1(K) LED7.1(K) Q3.2(S) Q4.2(S) Q5.2(S) Q6.2(S) Q8.2(S) Q9.2(S) Q10.2(S) Q11.2(S) R1.1 R2.1 R3.1 R4.1 R7.1 R8.1 R9.1 R10.1 R11.1 R12.1 R13.1 R14.1 R15.1 R16.1 R17.1 R18.1 R24.1 R25.1 R27.1 R28.1 R30.1 R32.1 R35.1 R38.1 R41.1 R42.1 R45.1 R46.1 R49.1 R100.1 R103.2 R104.1 R108.2 R109.2 R112.2 R118.2 R119.2 R120.1 R121.1 R122.1 U1.8(GND) U1.11(PAD) U2.8(GND) U2.11(PAD) U3.8(GND) U3.11(PAD) U4.8(GND) U4.11(PAD) U5.2 U6.2 U7.2 U8.2 U9.2 U10.2 U11.2 U12.2 U13.2 U14.8(GND) U14.11(PAD) U15.8(GND) U15.11(PAD) U16.8(GND) U16.11(PAD) U17.8(GND) U17.11(PAD) U18.8(GND) U18.11(PAD) U19.8(GND) U19.11(PAD) U20.8(GND) U20.11(PAD) U21.8(GND) U21.11(PAD) U22.8(GND) U22.11(PAD) U23.8(GND) U23.11(PAD) U24.8(GND) U24.11(PAD) U25.8(GND) U25.11(PAD) U26.9(AGND) U26.10(PGND) U26.15(PGND) U26.16(PGND) U26.17(Sync) U27.3(-Vin) U27.4(-Vout) U27.5(-Sense) U29.2(PV+) U30.1(PV-) U31.2 U33.1(PV-) U35.1(PV-) U36.1(PV-) U38.1(PV-) U41.1(PV-) U42.1(PV-) U45.1(PV-) U46.2(VSS) U47.1(OE1#) U47.10(GND) U47.19(OE2#) U48.2(GND) U49.1(OE1#) U49.10(GND) U49.19(OE2#) U50.1(A0) U50.2(A1) U50.8(GND) U51.2(A1) U51.8(GND) U52.1(A0) U52.8(GND) U53.8(GND) U54.1(nSS) U54.8(Gnd) U55.4(GND) U55.5(A2/T1) U55.6(A1) U55.7(A0) U56.1(nSS) U56.8(Gnd) U57.1(nSS) U57.8(Gnd) U58.2(GND) U58.3(2A) U59.2(GND) U60.2(GND) U63.2(GND) U64.3(S) U65.3(S) U66.2(GND) U66.3(2A) U67.2(GND) U68.1(A0) U68.2(A1) U68.4(DGND) U68.5(AVSS) U69.GND U69.GND2 U69.GND3 U70.2(GND) U70.5(GND) U71.2 U76.3(S)
VBatt_measure: C69.2 R21.1 R24.2 U68.7(AIN2)
3.3: R113.1 U46.5(VIN) U55.8(VDD)
A/D_reset_L: R54.2 U68.3(RESET#)
Batt_off_L: Q9.1(G) R43.1 U69.D14
Cam_long_H: R108.1 U59.1(1A) U59.3(2A) U69.D5
Cam_short_H: R109.1 R112.1 R119.1 U60.1(1A) U60.3(2A) U63.1(1A) U63.3(2A) U67.1(1A) U67.3(2A) U69.D6
Charger_on_L: Q11.1(G) R49.2 U69.D15
Data_ready_L: U68.14(DRDY#) U69.A3
Fan_H: U65.1(G) U69.A1 U76.1(G)
Filtered_15V: C3.2 C5.2 C8.2 C12.2 C13.2 C16.2 C19.2 C24.2 C25.2 C28.2 C31.2 C36.2 C37.2 C40.2 C43.2 C48.2 D2.2(A) D6.2(A) D7.2(A) D8.2(A) D9.2(A) D10.2(A) D11.2(A) D12.2(A) D13.2(A) D14.2(A) D15.2(A) D16.2(A) D17.2(A) D18.2(A) D19.2(A) D20.2(A) J1.1 J2.1 J3.1 J4.1 J5.1 J6.1 J7.1 J8.1 J9.1 J10.1 J11.1 J12.1 J13.1 J14.1 J15.1 J16.1 R5.2 R6.2 U5.1 U6.1 U7.1 U8.1 U9.1 U10.1 U11.1 U12.1 U13.1
Filtered_moisture: J25.1 R115.2 R117.1
Flash_Fast_B_H: U69.D4
Heater_H: U64.1(G) U69.A0
IMU0_reset_L: CN4.5 R53.2
IMU1_reset_L: CN3.5 R55.2
IMU2_reset_L: CN2.5 R57.2
IMU3_reset_L: CN1.5 R59.2
IMU4_reset_L: CN7.5 R62.2
IMU5_reset_L: CN5.5 R64.2
IMU6_reset_L: CN8.5 R65.2
IMU7_reset_L: CN6.5 R67.2
LED_ON_H: U1.3(EN) U2.3(EN) U3.3(EN) U4.3(EN) U14.3(EN) U15.3(EN) U16.3(EN) U17.3(EN) U18.3(EN) U19.3(EN) U20.3(EN) U21.3(EN) U22.3(EN) U23.3(EN) U24.3(EN) U25.3(EN)
LED_on_H: R101.1 R104.2 U58.6(1Y) U66.6(1Y)
Local_I2C_reset_L: R100.2 U48.1(1A) U48.3(2A) U50.3(RESET#) U51.3(RESET#) U52.3(RESET#) U53.3(RESET#) U69.D16
Moisture: C66.2 R117.2 U68.11(AIN0)
Pet_dog_H: U46.4(WD) U69.A2
Reset_Buffer_0_L: R61.2 U49.2(A1) U49.3(A2) U49.4(A3) U49.5(A4) U49.6(A5) U49.7(A6) U49.8(A7) U49.9(A8)
Reset_Buffer_1_L: R52.2 U47.2(A1) U47.3(A2) U47.4(A3) U47.5(A4) U47.6(A5) U47.7(A6) U47.8(A7) U47.9(A8)
RST_Pressure_0_L: R51.2 U54.10(nRST)
RST_Pressure_1_L: R56.2 U56.10(nRST)
RST_Pressure_2_L: R60.2 U57.10(nRST)
SCL_A/D: R92.1 U52.10(SC2) U68.16(SCL)
SCL_IMU0: CN4.4 R71.1 U50.5(SC0)
SCL_IMU1: CN3.4 R73.1 U50.7(SC1)
SCL_IMU2: CN2.4 R75.1 U50.10(SC2)
SCL_IMU3: CN1.4 R77.1 U50.12(SC3)
SCL_IMU4: CN7.4 R79.1 U51.5(SC0)
SCL_IMU5: CN5.4 R81.1 U51.7(SC1)
SCL_IMU6: CN8.4 R83.1 U51.10(SC2)
SCL_IMU7: CN6.4 R85.1 U51.12(SC3)
SCL_Pressure_0: R95.1 U53.5(SC0) U54.2(MOSI/SCL)
SCL_Pressure_1: R97.1 U53.7(SC1) U56.2(MOSI/SCL)
SCL_Pressure_2: R99.1 U53.10(SC2) U57.2(MOSI/SCL)
SCL_Spare: CN9.4 R90.1 U52.12(SC3)
SCL_Temp_external: CN10.4 R89.1 U52.7(SC1)
SCL_Temp_internal: R87.1 U52.5(SC0) U55.2(CLK)
SCL_uP: R68.1 U50.14(SCL) U51.14(SCL) U69.D3
SCL_Up: U52.14(SCL) U53.14(SCL)
SDA_A/D: R93.1 U52.9(SD2) U68.15(SDA)
SDA_IMU0: CN4.3 R70.1 U50.4(SD0)
SDA_IMU1: CN3.3 R72.1 U50.6(SD1)
SDA_IMU2: CN2.3 R74.1 U50.9(SD2)
SDA_IMU3: CN1.3 R76.1 U50.11(SD3)
SDA_IMU4: CN7.3 R78.1 U51.4(SD0)
SDA_IMU5: CN5.3 R80.1 U51.6(SD1)
SDA_IMU6: CN8.3 R82.1 U51.9(SD2)
SDA_IMU7: CN6.3 R84.1 U51.11(SD3)
SDA_Pressure_0: R94.1 U53.4(SD0) U54.3(MISO/SDA)
SDA_Pressure_1: R96.1 U53.6(SD1) U56.3(MISO/SDA)
SDA_Pressure_2: R98.1 U53.9(SD2) U57.3(MISO/SDA)
SDA_Spare: CN9.3 R91.1 U52.11(SD3)
SDA_Temp_external: CN10.3 R88.1 U52.6(SD1)
SDA_Temp_internal: R86.1 U52.4(SD0) U55.1(DATA)
SDA_uP: R69.1 U50.15(SDA) U51.15(SDA) U69.D2
SDA_Up: U52.15(SDA) U53.15(SDA)
Spare_I2C_reset_L: CN9.5 R58.2
Temp_I2C_reset_L: CN10.5 R50.2
UP_LED_ON_H: R103.1 R118.1 U58.1(1A) U66.1(1A) U69.D10
up_Reset_L: U46.1(RESETB) U69.RST
V_Batt: Q1.2(S) R19.2 R36.2 U39.5(D) U43.6(DRAIN) U44.1(S) U44.2(S) U44.3(S) U74.2
V_Sense_H: Q3.1(G) Q4.1(G) Q8.1(G) R120.2 U69.D7
VA_measure: C70.2 R22.1 R25.2 U68.10(AIN1)
VB_measure: C68.2 R31.1 R32.2 U68.6(AIN3)
Net-(C1-1): C1.1 U1.9(SLOPE)
Net-(C2-2): C2.2 J2.2 U2.5(DRAIN)
Net-(C4-1): C4.1 U2.9(SLOPE)
Net-(C6-2): C6.2 J3.2 U3.5(DRAIN)
Net-(C7-1): C7.1 U3.9(SLOPE)
Net-(C9-2): C9.2 J1.2 U1.5(DRAIN)
Net-(C10-2): C10.2 J4.2 U4.5(DRAIN)
Net-(C11-1): C11.1 U4.9(SLOPE)
Net-(C14-1): C14.1 U14.9(SLOPE)
Net-(C15-2): C15.2 J5.2 U14.5(DRAIN)
Net-(C17-1): C17.1 U15.9(SLOPE)
Net-(C18-2): C18.2 J6.2 U15.5(DRAIN)
Net-(C20-1): C20.1 U16.9(SLOPE)
Net-(C21-2): C21.2 J7.2 U16.5(DRAIN)
Net-(C22-2): C22.2 J8.2 U17.5(DRAIN)
Net-(C23-1): C23.1 U17.9(SLOPE)
Net-(C26-1): C26.1 U18.9(SLOPE)
Net-(C27-2): C27.2 J9.2 U18.5(DRAIN)
Net-(C29-1): C29.1 U19.9(SLOPE)
Net-(C30-2): C30.2 J10.2 U19.5(DRAIN)
Net-(C32-1): C32.1 U20.9(SLOPE)
Net-(C33-2): C33.2 J11.2 U20.5(DRAIN)
Net-(C34-2): C34.2 J12.2 U21.5(DRAIN)
Net-(C35-1): C35.1 U21.9(SLOPE)
Net-(C38-1): C38.1 U22.9(SLOPE)
Net-(C39-2): C39.2 J13.2 U22.5(DRAIN)
Net-(C41-1): C41.1 U23.9(SLOPE)
Net-(C42-2): C42.2 J14.2 U23.5(DRAIN)
Net-(C44-1): C44.1 U24.9(SLOPE)
Net-(C45-2): C45.2 J15.2 U24.5(DRAIN)
Net-(C46-2): C46.2 J16.2 U25.5(DRAIN)
Net-(C47-1): C47.1 U25.9(SLOPE)
Net-(C59-2): C59.2 U26.7(SS)
Net-(C74-2): C74.2 D1.1 D1.2 U70.3(Vin) U71.1
Net-(CN11-4): CN11.4 R102.2
Net-(CN12-4): CN12.4 R106.2
Net-(CN13-4): CN13.4 R116.2
Net-(CN14-4): CN14.4 R114.2
Net-(CN15-4): CN15.4 R111.2
Net-(CN16-4): CN16.4 R110.2
Net-(CN17-4): CN17.4 R105.2
Net-(CN18-4): CN18.4 R107.2
Net-(D2-1): D2.1(C) U1.1(VCC) U1.2(PWM)
Net-(D3-1): D3.1(C) U73.1
Net-(D3-2): D3.2(A) U29.1(PV-)
Net-(D4-1): D4.1(C) U72.1
Net-(D4-2): D4.2(A) U36.2(PV+)
Net-(D5-1): D5.1(C) U74.1
Net-(D5-2): D5.2(A) U41.2(PV+)
Net-(D6-1): D6.1(C) U2.1(VCC) U2.2(PWM)
Net-(D7-1): D7.1(C) U3.1(VCC) U3.2(PWM)
Net-(D8-1): D8.1(C) U4.1(VCC) U4.2(PWM)
Net-(D9-1): D9.1(C) U14.1(VCC) U14.2(PWM)
Net-(D10-1): D10.1(C) U15.1(VCC) U15.2(PWM)
Net-(D11-1): D11.1(C) U16.1(VCC) U16.2(PWM)
Net-(D12-1): D12.1(C) U17.1(VCC) U17.2(PWM)
Net-(D13-1): D13.1(C) U18.1(VCC) U18.2(PWM)
Net-(D14-1): D14.1(C) U19.1(VCC) U19.2(PWM)
Net-(D15-1): D15.1(C) U20.1(VCC) U20.2(PWM)
Net-(D16-1): D16.1(C) U21.1(VCC) U21.2(PWM)
Net-(D17-1): D17.1(C) U22.1(VCC) U22.2(PWM)
Net-(D18-1): D18.1(C) U23.1(VCC) U23.2(PWM)
Net-(D19-1): D19.1(C) U24.1(VCC) U24.2(PWM)
Net-(D20-1): D20.1(C) U25.1(VCC) U25.2(PWM)
Net-(H1-1): H1.1 R113.2 U46.3(EN/ENB)
Net-(LED1-2): LED1.2(A) R33.1
Net-(LED2-2): LED2.2(A) R34.1
Net-(LED3-2): LED3.2(A) R36.1
Net-(LED4-2): LED4.2(A) R37.1
Net-(LED5-2): LED5.2(A) R39.1
Net-(LED6-2): LED6.2(A) R40.1
Net-(LED7-2): LED7.2(A) R123.1
Net-(Q1-1): Q1.1(G) Q3.3(D) R19.1
Net-(Q1-3): Q1.3(D) R21.2
Net-(Q2-1): Q2.1(G) Q4.3(D) R20.1
Net-(Q2-3): Q2.3(D) R22.2
Net-(Q5-3): Q5.3(D) R23.1 R28.2 U26.5(EN/UVLO)
Net-(Q6-3): Q6.3(D) R26.1 R30.2 U27.2(On/Off)
Net-(Q7-1): Q7.1(G) Q8.3(D) R29.1
Net-(Q7-3): Q7.3(D) R31.2
Net-(Q9-3): Q9.3(D) R44.2 U40.4(G)
Net-(Q10-1): Q10.1(G) Q11.3(D) R48.1
Net-(Q10-3): Q10.3(D) R47.2 U44.4(G)
Net-(R1-2): R1.2 U1.6(SOURCE) U1.7(FB)
Net-(R2-2): R2.2 U2.6(SOURCE) U2.7(FB)
Net-(R3-2): R3.2 U3.6(SOURCE) U3.7(FB)
Net-(R4-2): R4.2 U4.6(SOURCE) U4.7(FB)
Net-(R7-2): R7.2 U14.6(SOURCE) U14.7(FB)
Net-(R8-2): R8.2 U15.6(SOURCE) U15.7(FB)
Net-(R9-2): R9.2 U16.6(SOURCE) U16.7(FB)
Net-(R10-2): R10.2 U17.6(SOURCE) U17.7(FB)
Net-(R11-2): R11.2 U18.6(SOURCE) U18.7(FB)
Net-(R12-2): R12.2 U19.6(SOURCE) U19.7(FB)
Net-(R13-2): R13.2 U20.6(SOURCE) U20.7(FB)
Net-(R14-2): R14.2 U21.6(SOURCE) U21.7(FB)
Net-(R15-2): R15.2 U22.6(SOURCE) U22.7(FB)
Net-(R16-2): R16.2 U23.6(SOURCE) U23.7(FB)
Net-(R17-2): R17.2 U24.6(SOURCE) U24.7(FB)
Net-(R18-2): R18.2 U25.6(SOURCE) U25.7(FB)
Net-(R27-2): R27.2 U26.6(Vset)
Net-(R35-2): R35.2 U32.2(REF)
Net-(R38-2): R38.2 U28.4(G) U32.3(BIAS)
Net-(R41-2): R41.2 U37.2(REF)
Net-(R42-2): R42.2 U34.4(G) U37.3(BIAS)
Net-(R44-1): R44.1 U39.1(S) U39.2(S) U39.3(S) U40.1(S) U40.2(S) U40.3(S) U43.4(SOURCE)
Net-(R45-2): R45.2 U43.2(REF)
Net-(R46-2): R46.2 U39.4(G) U43.3(BIAS)
Net-(R47-1): R47.1 R48.2 U44.5(D) U45.2(PV+)
Net-(R50-1): R50.1 U47.18(Y1)
Net-(R51-1): R51.1 U47.17(Y2)
Net-(R52-1): R52.1 U48.6(1Y)
Net-(R53-1): R53.1 U49.18(Y1)
Net-(R54-1): R54.1 U47.16(Y3)
Net-(R55-1): R55.1 U49.17(Y2)
Net-(R56-1): R56.1 U47.15(Y4)
Net-(R57-1): R57.1 U49.16(Y3)
Net-(R58-1): R58.1 U47.14(Y5)
Net-(R59-1): R59.1 U49.15(Y4)
Net-(R60-1): R60.1 U47.13(Y6)
Net-(R61-1): R61.1 U48.4(2Y)
Net-(R62-1): R62.1 U49.14(Y5)
Net-(R63-1): R63.1 U47.12(Y7)
Net-(R64-1): R64.1 U49.13(Y6)
Net-(R65-1): R65.1 U49.12(Y7)
Net-(R66-1): R66.1 U47.11(Y8)
Net-(R67-1): R67.1 U49.11(Y8)
Net-(R102-1): R102.1 U59.6(1Y)
Net-(R105-1): R105.1 U60.6(1Y)
Net-(R106-1): R106.1 U59.4(2Y)
Net-(R107-1): R107.1 U60.4(2Y)
Net-(R110-1): R110.1 U63.6(1Y)
Net-(R111-1): R111.1 U63.4(2Y)
Net-(R114-1): R114.1 U67.6(1Y)
Net-(R116-1): R116.1 U67.4(2Y)
Net-(U61-2): U61.2(PV+) U65.2(D)
Net-(U62-2): U62.2(PV+) U64.2(D)
Net-(U75-2): U75.2(PV+) U76.2(D)

Not connected (* = marked no-connect by the designer): CN11 3*; CN12 3*; CN13 3*; CN14 3*; CN15 3*; CN16 3*; CN17 3*; CN18 3*; H1 3*; R63 2*; R66 2*; U1 4(NC)* 10(DISC)*; U2 4(NC)* 10(DISC)*; U3 4(NC)* 10(DISC)*; U4 4(NC)* 10(DISC)*; U14 4(NC)* 10(DISC)*; U15 4(NC)* 10(DISC)*; U16 4(NC)* 10(DISC)*; U17 4(NC)* 10(DISC)*; U18 4(NC)* 10(DISC)*; U19 4(NC)* 10(DISC)*; U20 4(NC)* 10(DISC)*; U21 4(NC)* 10(DISC)*; U22 4(NC)* 10(DISC)*; U23 4(NC)* 10(DISC)*; U24 4(NC)* 10(DISC)*; U25 4(NC)* 10(DISC)*; U26 8(PG)*; U27 6(Trim)*; U32 1(NC)* 5(NC)*; U37 1(NC)* 5(NC)*; U43 1(NC)* 5(NC)*; U53 11(SD3)* 12(SC3)*; U54 4(SCK)* 5(DNC)* 6(DNC)* 7(DNC)* 11(DAV)*; U55 3(INT)*; U56 4(SCK)* 5(DNC)* 6(DNC)* 7(DNC)* 11(DAV)*; U57 4(SCK)* 5(DNC)* 6(DNC)* 7(DNC)* 11(DAV)*; U58 4(2Y)*; U66 4(2Y)*; U68 8(REFN)* 9(REFP)*; U69 RX1* TX0* VCC; U70 1(PF)*

## Notes on the sheets
sheet 1
- Notes:
- Added fuses and shottky on power supply inputs
- Added shotkky diodes on LED drivers
- Use RL0816T-R056-F: 1/4 Watt 56mOhm resistor
- Add bypass capacitor pair close to processor
- LED drivers
- (Still 0603)
- Add bypass capacitor pair close to processor
- Power on 1 ohm?
sheet 2
- Don't do no connect on an input (Sync)
- Power dissipated
- 10A, 120W output
- Trim?
- What is this for?
- ORing Circuits
- should be 12V
- 3 Jetsons
- Fuse:0312030.HXP
- LED indicators
- 2 Aux
- Missing its pair
- Connection for charger
sheet 3
- Two shottkys instead?
- I2C Pull ups
- I2C connectors
- IMUs
- Resistors to terminate LED line
- Long cam triggers
- two buffers to increase drive, changed R -> 150
- Short cam triggers
- Spare
- Temperature sensor (External)
- Add capacitors to mitigate fast turn off/inductance of wires
- Pet comes from Jetson
- Bypass capacitor near processor
- SNT-100-BK-G: Shunt
